# EAGLE design weft-uiboard2 (EAGLE 8.4.0)
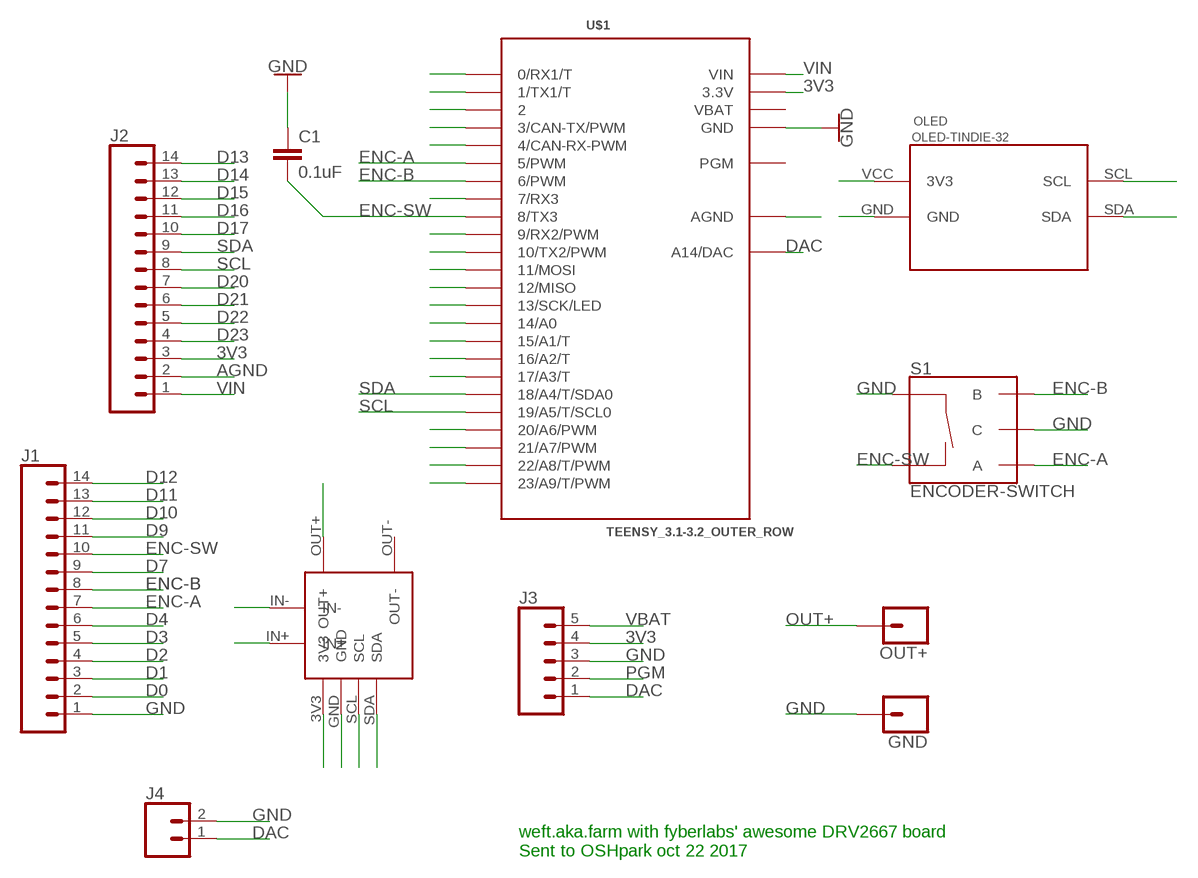
[diagram p0: schematic, sheet 1]

## Parts
C1  0.1uF  1.0UF-0805-25V-(+80/-20%)  [0805]
DRV2667  fyberlabs!  DRV2667-TINDIE  [DRV2667-TINDIE]
GND  CONN_01OFFSET  [1X01_OFFSET]
J1  CONN_14LOCK_LONGPADS  [1X14_LOCK_LONGPADS]
J2  CONN_14LOCK_LONGPADS  [1X14_LOCK_LONGPADS]
J3  CONN_05LOCK_LONGPADS  [1X05_LOCK_LONGPADS]
J4  CONN_02LOCK_LONGPADS  [1X02_LOCK_LONGPADS]
OLED  OLED-TINDIE-32  [OLED-TINDIE-32]
OUT+  CONN_01OFFSET  [1X01_OFFSET]
S1  ENCODER-SWITCH  [ROTARY_ENC_PLAIN]
U$1  TEENSY_3.1-3.2_OUTER_ROW  [TEENSY_3.0-3.2&LC_OUTER_ROW]

## Nets
3V3: DRV2667.3V3 J2.3 J3.4 OLED.VCC(3V3) U$1.3.3V U$1.3.3V1(3.3V)
AGND: J2.2 U$1.AGND
D0: J1.2 U$1.0(0/RX1/T)
D1: J1.3 U$1.1(1/TX1/T)
D2: J1.4 U$1.2
D3: J1.5 U$1.3(3/CAN-TX/PWM)
D4: J1.6 U$1.4(4/CAN-RX-PWM)
D7: J1.9 U$1.7(7/RX3)
D9: J1.11 U$1.9(9/RX2/PWM)
D10: J1.12 U$1.10(10/TX2/PWM)
D11: J1.13 U$1.11(11/MOSI)
D12: J1.14 U$1.12(12/MISO)
D13: J2.14 U$1.13(13/SCK/LED)
D14: J2.13 U$1.14/A0
D15: J2.12 U$1.15/A1(15/A1/T)
D16: J2.11 U$1.16/A2(16/A2/T)
D17: J2.10 U$1.17/A3(17/A3/T)
D20: J2.7 U$1.20/A6(20/A6/PWM)
D21: J2.6 U$1.21/A7(21/A7/PWM)
D22: J2.5 U$1.22/A8(22/A8/T/PWM)
D23: J2.4 U$1.23/A9(23/A9/T/PWM)
DAC: DRV2667.IN+ J3.1 J4.1 U$1.RESET/DAC(A14/DAC)
ENC-A: J1.7 S1.A U$1.5(5/PWM)
ENC-B: J1.8 S1.B U$1.6(6/PWM)
ENC-SW: C1.2 J1.10 S1.SW- U$1.8(8/TX3)
GND: C1.1 DRV2667.GND DRV2667.IN- GND.1 J1.1 J3.3 J4.2 OLED.GND S1.C S1.SW+ U$1.GND U$1.GND1(GND)
OUT+: DRV2667.OUT+ OUT+.1
PGM: J3.2
SCL: DRV2667.SCL J2.8 OLED.SCL U$1.19/A5(19/A5/T/SCL0)
SDA: DRV2667.SDA J2.9 OLED.SDA U$1.18/A4(18/A4/T/SDA0)
VBAT: J3.5
VIN: J2.1 U$1.VIN
Unconnected: DRV2667.OUT- U$1.PGM

## Notes on the sheet
- weft.aka.farm with fyberlabs' awesome DRV2667 board
  Sent to OSHpark oct 22 2017

## Power pins joined to a net without a drawn wire
VBAT: U$1.VBAT

## Library data of the parts
C1 = SparkFun-Capacitors:1.0UF: 1µF ceramic capacitors A capacitor is a passive two-terminal electrical component used to store electrical energy temporarily in an electric field.; PROD_ID: CAP-11625; VALUE: 1.0uF
DRV2667 = AKA_lib:DRV2667-TINDIE: Tindie DRV2667 breakout board from Fyber Labs <https://www.tindie.com/products/Fyberlabs/piezo-haptic-flex-module/>
GND OUT+ = SparkFun-Connectors:CONN_01: Single connection point. Often used as Generic Header-pin footprint for 0.1 inch spaced/style header connections On any of the 0.1 inch spaced packages, you can populate with these: Break Away Headers - Straight <https://www.sparkfun.com/products/116> (PRT-00116) Break Away Male Headers - Right Angle <https://www.sparkfun.com/products/553> (PRT-00553) Female Headers <https://www.sparkfun.com/products/115> (PRT-00115) Break Away Headers - Machine Pin <https://www.sparkfun.com/products/117> (PRT-00117) Break Away Female Headers - Swiss Machine Pin <https://www.sparkfun.com/products/743> (PRT-00743) This device is also useful as a general connection point to wire up your design to another part of your project. Our various solder wires solder well into these plated through hole pads. Hook-Up Wire - Assortment (Stranded, 22 AWG) <https://www.sparkfun.com/products/11375> (PRT-11375) Hook-Up Wire - Assortment (Solid Core, 22 AWG) <https://www.sparkfun.com/products/11367> (PRT-11367) View the entire wire category on our website here <https://www.sparkfun.com/categories/141> Special notes: SMTSO-256-ET is a "flush mount" nut for a 4-40 screw. We mostly use this on specialty testbeds; it is a nice way to connect hardware to your PCB at an adjustable hieght. Also note, the SNAP packages are for using a snappable style connector. We sell a baggie of snaps and they are also used on two LilyPad designs: Snap Assortment - 30 pack (male and female) <https://www.sparkfun.com/products/11347> (DEV-11347) LilyPad Arduino SimpleSnap <https://www.sparkfun.com/products/10941> (DEV-10941) LilyPad SimpleSnap Protoboard <https://www.sparkfun.com/products/10940> (DEV-10940)
J1 J2 = SparkFun-Connectors:CONN_14: Multi connection point. Often used as Generic Header-pin footprint for 0.1 inch spaced/style header connections On any of the 0.1 inch spaced packages, you can populate with these: Break Away Headers - Straight <https://www.sparkfun.com/products/116> (PRT-00116) Break Away Male Headers - Right Angle <https://www.sparkfun.com/products/553> (PRT-00553) Female Headers <https://www.sparkfun.com/products/115> (PRT-00115) Break Away Headers - Machine Pin <https://www.sparkfun.com/products/117> (PRT-00117) Break Away Female Headers - Swiss Machine Pin <https://www.sparkfun.com/products/743> (PRT-00743) For SCREWTERMINALS and SPRING TERMINALS visit here: Screw Terimnals on SparkFun.com <https://www.sparkfun.com/search/results?term=Screw+Terminals> (5mm/3.5mm/2.54mm spacing) This device is also useful as a general connection point to wire up your design to another part of your project. Our various solder wires solder well into these plated through hole pads. Hook-Up Wire - Assortment (Stranded, 22 AWG) <https://www.sparkfun.com/products/11375> (PRT-11375) Hook-Up Wire - Assortment (Solid Core, 22 AWG) <https://www.sparkfun.com/products/11367> (PRT-11367) View the entire wire category on our website here <https://www.sparkfun.com/categories/141> Special notes: Molex polarized connector foot print use with SKU : PRT-08231 with associated crimp pins and housings. 1MM SMD Version SKU: PRT-10208 NOTES ON THE VARIANTS LOCK and LOCK_LONGPADS... This footprint was designed to help hold the alignment of a through-hole component (i.e. 6-pin header) while soldering it into place. You may notice that each hole has been shifted either up or down by 0.005 of an inch from it's more standard position (which is a perfectly straight line). This slight alteration caused the pins (the squares in the middle) to touch the edges of the holes. Because they are alternating, it causes a "brace" to hold the component in place. 0.005 has proven to be the perfect amount of "off-center" position when using our standard breakaway headers. Although looks a little odd when you look at the bare footprint, once you have a header in there, the alteration is very hard to notice. Also,if you push a header all the way into place, it is covered up entirely on the bottom side.
J3 = SparkFun-Connectors:CONN_05: Multi connection point. Often used as Generic Header-pin footprint for 0.1 inch spaced/style header connections On any of the 0.1 inch spaced packages, you can populate with these: Break Away Headers - Straight <https://www.sparkfun.com/products/116> (PRT-00116) Break Away Male Headers - Right Angle <https://www.sparkfun.com/products/553> (PRT-00553) Female Headers <https://www.sparkfun.com/products/115> (PRT-00115) Break Away Headers - Machine Pin <https://www.sparkfun.com/products/117> (PRT-00117) Break Away Female Headers - Swiss Machine Pin <https://www.sparkfun.com/products/743> (PRT-00743) For SCREWTERMINALS and SPRING TERMINALS visit here: Screw Terimnals on SparkFun.com <https://www.sparkfun.com/search/results?term=Screw+Terminals> (5mm/3.5mm/2.54mm spacing) This device is also useful as a general connection point to wire up your design to another part of your project. Our various solder wires solder well into these plated through hole pads. Hook-Up Wire - Assortment (Stranded, 22 AWG) <https://www.sparkfun.com/products/11375> (PRT-11375) Hook-Up Wire - Assortment (Solid Core, 22 AWG) <https://www.sparkfun.com/products/11367> (PRT-11367) View the entire wire category on our website here <https://www.sparkfun.com/categories/141> Special notes: Molex polarized connector foot print use with SKU : PRT-08231 with associated crimp pins and housings. 1MM SMD Version SKU: PRT-10208
J4 = SparkFun-Connectors:CONN_02: Multi connection point. Often used as Generic Header-pin footprint for 0.1 inch spaced/style header connections On any of the 0.1 inch spaced packages, you can populate with these: Break Away Headers - Straight <https://www.sparkfun.com/products/116> (PRT-00116) Break Away Male Headers - Right Angle <https://www.sparkfun.com/products/553> (PRT-00553) Female Headers <https://www.sparkfun.com/products/115> (PRT-00115) Break Away Headers - Machine Pin <https://www.sparkfun.com/products/117> (PRT-00117) Break Away Female Headers - Swiss Machine Pin <https://www.sparkfun.com/products/743> (PRT-00743) For SCREWTERMINALS and SPRING TERMINALS visit here: Screw Terimnals on SparkFun.com <https://www.sparkfun.com/search/results?term=Screw+Terminals> (5mm/3.5mm/2.54mm spacing) This device is also useful as a general connection point to wire up your design to another part of your project. Our various solder wires solder well into these plated through hole pads. Hook-Up Wire - Assortment (Stranded, 22 AWG) <https://www.sparkfun.com/products/11375> (PRT-11375) Hook-Up Wire - Assortment (Solid Core, 22 AWG) <https://www.sparkfun.com/products/11367> (PRT-11367) View the entire wire category on our website here <https://www.sparkfun.com/categories/141> Special notes: Molex polarized connector foot print use with: PRT-08233 with associated crimp pins and housings. 2.54_SCREWTERM for use with PRT-10571. 3.5mm Screw Terminal footprints for PRT-08084 5mm Screw Terminal footprints for use with PRT-08432
OLED = AKA_lib:OLED-TINDIE-32
S1 = SparkFun-Switches:ENCODER-SWITCH: Rotary Encoder w/ Select Switch Encoders rotate similarly to potentiometers, but they’re different from potentiometers in that an encoder has full rotation without limits. They output gray code so that you can tell how much and in which direction the encoder has been turned. This encoder includes a push-down select switch built into the shaft. SparkFun Products Rotary Encoder <https://www.sparkfun.com/products/9117> (COM-09117); SF_SKU: COM-09117
U$1 = Teensy_3_and_LC_Series_Boards_v1.4:TEENSY_3.1-3.2_OUTER_ROW: Footprint for Teensy 3.1 or 3.2 board using all pin connections on the outer perimeter

## Board
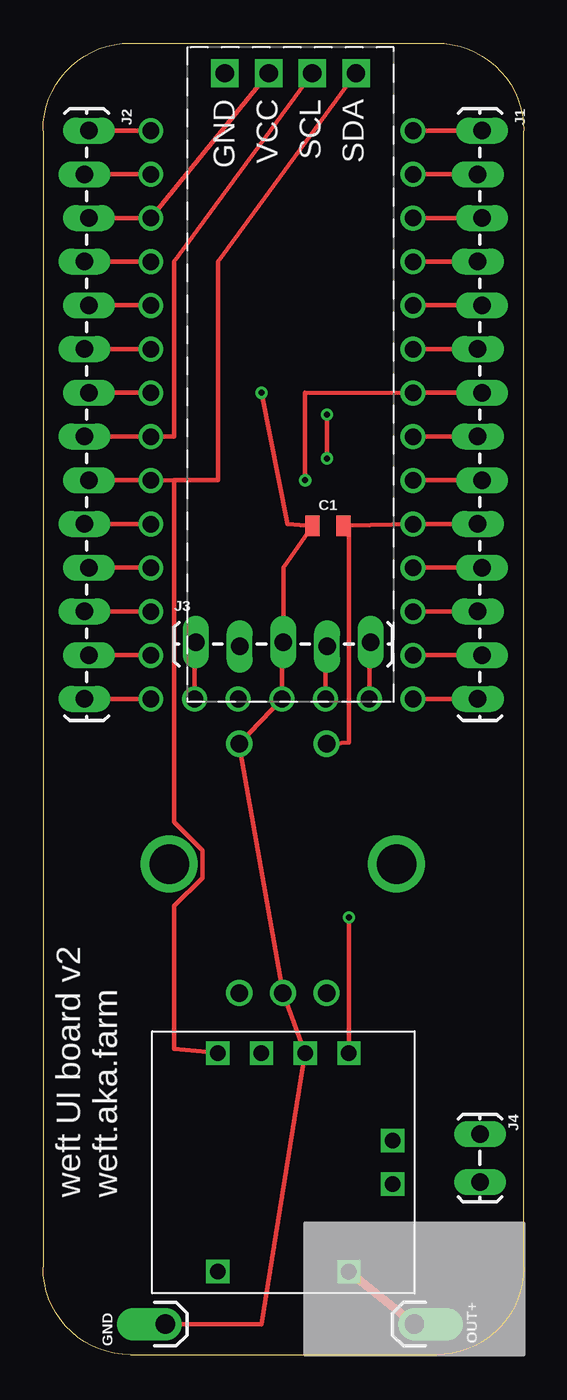
[diagram p1: board, top side]
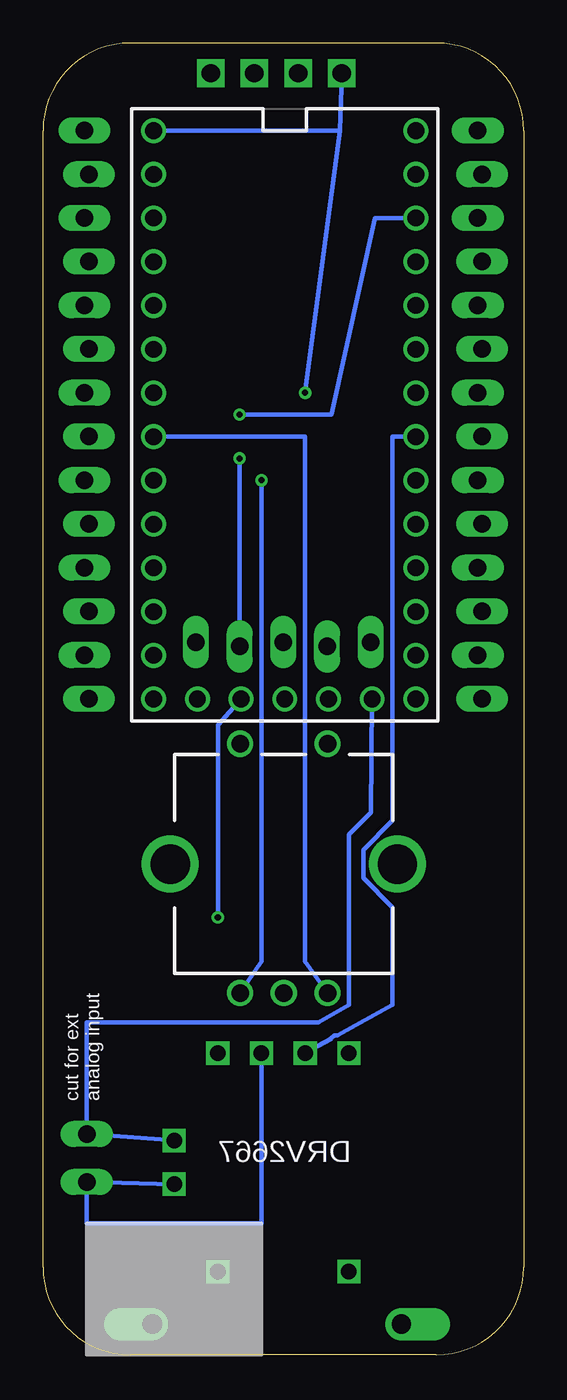
[diagram p2: board, bottom side, seen from below]

Size 27.94 x 76.2 mm. Coordinates in mm from the lower left corner, seen from the top.
Outline: 27.94,5.08 27.94,71.12 arc90 22.86,76.2 5.08,76.2 arc90 0,71.12 0,5.08 arc90 5.08,0 22.86,0 arc90 27.94,5.08
Copper layers (1*16): Top 0.0356mm / dielectric 1.5011mm / Bottom 0.0356mm
Design rules "LaenPCBOrder": minimum track width 6mil, minimum drill 13mil, track to track 6mil, track to pad 6mil, pad to pad 6mil, via to via 6mil, smd to smd 6mil, copper to edge 15mil, drill to drill 6mil, minimum pad ring 7mil, minimum via ring 7mil, stop-mask expansion 3mil, vias tented up to drill 0mil, thermal gap 10mil

### Footprints (pad centres in the part's own frame; a part is rotated, then mirrored left to right if it is on the bottom)
0805 = smd 0.8 x 1.2: 1 -0.9,0; 2 0.9,0
DRV2667-TINDIE = drill 0.9 square: 3V3 0,0; GND 2.54,0; IN+ -2.54,5.08; IN- -2.54,7.62; OUT+ 0,12.7; OUT- 7.62,12.7; SCL 5.08,0; SDA 7.62,0
1X01_OFFSET = drill 1.118 pad 1.88 offset: 1 0,0
1X14_LOCK_LONGPADS = drill 1.016 long: 1 0,0.127; 2 2.54,-0.127; 3 5.08,0.127; 4 7.62,-0.127; 5 10.16,0.127; 6 12.7,-0.127; 7 15.24,0.127; 8 17.78,-0.127; 9 20.32,0.127; 10 22.86,-0.127; 11 25.4,0.127; 12 27.94,-0.127; 13 30.48,0.127; 14 33.02,-0.127
1X05_LOCK_LONGPADS = drill 1.016 long: 1 0,0; 2 2.54,-0.254; 3 5.08,0; 4 7.62,-0.254; 5 10.16,0
1X02_LOCK_LONGPADS = drill 1.016 long: 1 -0.127,0; 2 2.667,0
OLED-TINDIE-32 = drill 1.067 square: GND 1.5,2.19; SCL 1.5,7.27; SDA 1.5,9.81; VCC 1.5,4.73
ROTARY_ENC_PLAIN = drill 1.016: A 7.493,-2.54; B 7.493,2.54; C 7.493,0; SW+ -6.985,2.54; SW- -6.985,-2.54 | drill 2.286: P$3 0,6.604; P$4 0,-6.604
TEENSY_3.0-3.2&LC_OUTER_ROW = drill 0.965: 0 -7.62,13.97; 1 -7.62,11.43; 2 -7.62,8.89; 3 -7.62,6.35; 3.3V 7.62,11.43; 3.3V1 -2.54,-16.51; 4 -7.62,3.81; 5 -7.62,1.27; 6 -7.62,-1.27; 7 -7.62,-3.81; 8 -7.62,-6.35; 9 -7.62,-8.89; 10 -7.62,-11.43; 11 -7.62,-13.97; 12 -7.62,-16.51; 13 7.62,-16.51; 14/A0 7.62,-13.97; 15/A1 7.62,-11.43; 16/A2 7.62,-8.89; 17/A3 7.62,-6.35; 18/A4 7.62,-3.81; 19/A5 7.62,-1.27; 20/A6 7.62,1.27; 21/A7 7.62,3.81; 22/A8 7.62,6.35; 23/A9 7.62,8.89; AGND 7.62,13.97; GND -7.62,16.51; GND1 0,-16.51; PGM 2.54,-16.51; RESET/DAC 5.08,-16.51; VBAT -5.08,-16.51; VIN 7.62,16.51

### Placement (x,y rotation side)
C1  16.57,48.15 0 top
DRV2667  17.78,17.53 180 top
GND  7.11,1.78 90 top
J1  25.4,71.12 270 top
J2  2.54,71.12 270 top
J3  8.89,41.4 0 top
J4  25.4,12.7 270 top
OLED  8.38,75.95 270 top
OUT+  21.59,1.78 270 top
S1  13.94,28.51 270 bottom
U$1  13.89,54.6 0 bottom

### Tracks (layer width: path | path; a pad name or v marks a point on that pad's centre or on a via)
3V3  (via drill 0.35)
  Top 0.254: J2.3 6.26,66.04 U$1.3.3V OLED.VCC | U$1.3.3V1 16.43,41.07 J3.4 | v17.78,25.4 DRV2667.3V3 | v16.51,52.07 v16.51,54.61
  Bottom 0.254: U$1.3.3V1 17.78,36.58 v17.78,25.4 | J3.4 v16.51,52.07 | v16.51,54.61 11.18,54.61 8.64,66.04 U$1.3.3V
AGND
  Top 0.254: U$1.AGND 2.42,68.57 J2.2
D0
  Top 0.254: U$1.0 J1.2
D1
  Top 0.254: J1.3 U$1.1
D2
  Top 0.254: U$1.2 J1.4
D3
  Top 0.254: J1.5 U$1.3
D4
  Top 0.254: J1.6 U$1.4
D7
  Top 0.254: J1.9 U$1.7
D9
  Top 0.254: J1.11 U$1.9
D10
  Top 0.254: J1.12 U$1.10
D11
  Top 0.254: J1.13 U$1.11
D12
  Top 0.254: J1.14 U$1.12
D13
  Top 0.254: J2.14 6.26,38.1 U$1.13
D14
  Top 0.254: J2.13 6.26,40.64 U$1.14/A0
D15
  Top 0.254: J2.12 6.26,43.18 U$1.15/A1
D16
  Top 0.254: J2.11 6.26,45.72 U$1.16/A2
D17
  Top 0.254: J2.10 6.26,48.26 U$1.17/A3
D20
  Top 0.254: J2.7 6.26,55.88 U$1.20/A6
D21
  Top 0.254: U$1.21/A7 2.42,58.41 J2.6
D22
  Top 0.254: J2.5 6.26,60.96 U$1.22/A8
D23
  Top 0.254: U$1.23/A9 2.42,63.49 J2.4
DAC
  Top 0.254: U$1.RESET/DAC 8.81,41.32 J3.1
  Bottom 0.254: U$1.RESET/DAC 8.89,31.5 10.16,30.23 10.16,20.32 11.94,19.3 25.4,19.3 J4.1 DRV2667.IN+
ENC-A  (via drill 0.35)
  Top 0.254: J1.7 U$1.5 15.24,55.88 v15.24,50.8
  Bottom 0.254: v15.24,50.8 15.24,22.86 S1.A
ENC-B
  Top 0.254: J1.8 U$1.6
  Bottom 0.254: U$1.6 19.56,53.34 12.7,53.34 12.7,22.86 S1.B
ENC-SW
  Top 0.254: U$1.8 J1.10 | U$1.8 | 17.78,48.16 C1.2 | 17.78,48.16 U$1.8 | S1.SW- 17.78,35.56 17.78,48.16
GND  (via drill 0.35)
  Top 0.254: U$1.GND 25.52,71.11 J1.1 | GND.1 12.7,1.78 DRV2667.GND S1.C S1.SW+ U$1.GND1 13.89,41.32 J3.3 13.97,45.72 C1.1 14.22,48.26 v12.7,55.88
  Bottom 0.254: OLED.GND 10.67,71.12 | 10.67,71.12 U$1.GND | DRV2667.GND 15.24,7.62 25.4,7.62 J4.2 DRV2667.IN- | 10.67,71.12 v12.7,55.88
OUT+
  Top 0.508: DRV2667.OUT+ OUT+.1
SCL
  Top 0.254: J2.8 2.42,53.33 U$1.19/A5 7.62,53.34 7.62,63.5 OLED.SCL
  Bottom 0.254: U$1.19/A5 7.62,53.34 7.62,31.03 9.32,29.33 9.32,27.69 7.62,25.99 7.62,20.32 10.82,18.56 11,18.56 11.19,18.37 11.19,18.35 DRV2667.SCL
SDA
  Top 0.254: J2.9 6.26,50.8 U$1.18/A4 7.62,50.8 | 7.62,50.8 7.62,30.95 9.27,29.31 9.27,27.71 7.62,26.06 7.62,17.78 DRV2667.SDA | OLED.SDA 10.16,63.5 10.16,50.8 7.62,50.8
VBAT
  Top 0.254: U$1.VBAT 18.97,41.32 J3.5
VIN
  Top 0.254: J2.1 6.26,71.12 U$1.VIN

### Text on the board
tNames: weft UI board v2 / weft.aka.farm
bNames: cut for ext / analog input